# Altium schematic sheet projekt1.SchDoc
size A4
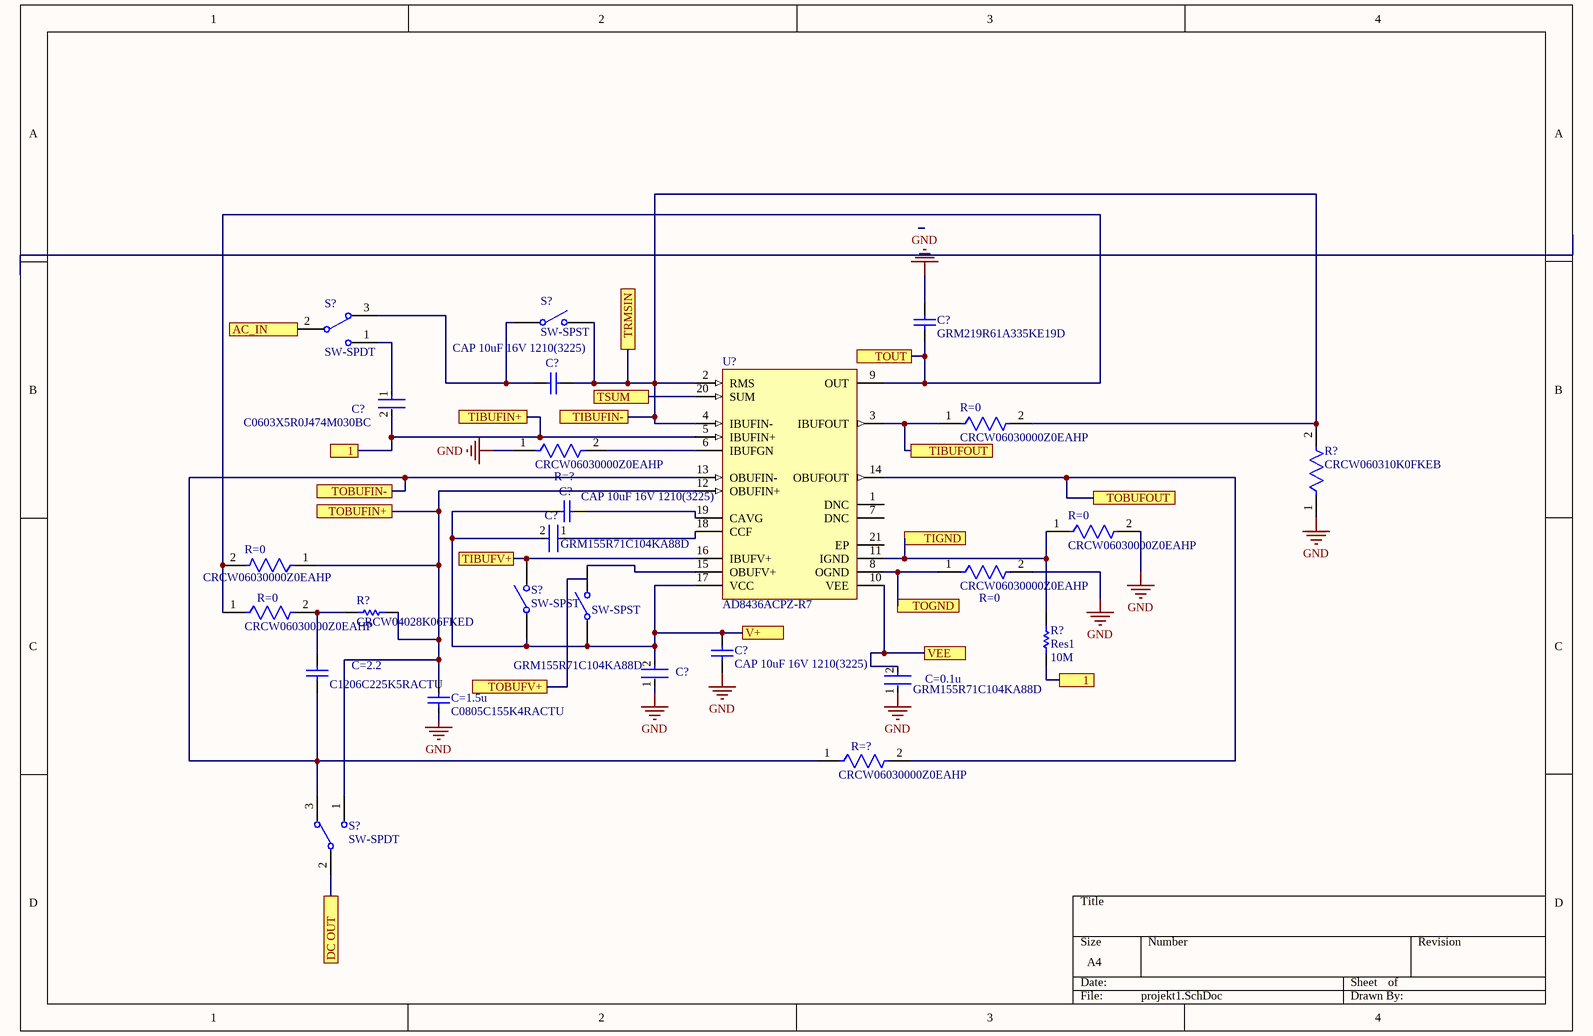
[diagram p0: projekt1.SchDoc]

## Parts
(Parts that share a designator on the sheet are numbered #1, #2 ... from top to bottom, then left to right.)
C=0.1u  GRM155R71C104KA88D  [FP-GRM15-MFG]
C=1.5u  C0805C155K4RACTU  [CAPC2013X140X50NL20T25]
C=2.2  C1206C225K5RACTU  [CAPC3216X180X50LL20T25]
C?#1  GRM219R61A335KE19D  [CAPC2013X95X45ML10T25]
C?#2  CAP 10uF 16V 1210(3225)  [CAPC1210(3225)190_N]
C?#3  C0603X5R0J474M030BC  [FP-C0603-030-0_03-IPC_B]
C?#4  CAP 10uF 16V 1210(3225)  [CAPC1210(3225)190_N]
C?#5  GRM155R71C104KA88D  [FP-GRM15-MFG]
C?#6  GRM155R71C104KA88D  [FP-GRM15-MFG]
C?#7  CAP 10uF 16V 1210(3225)  [CAPC1210(3225)190_N]
R=0#1  CRCW06030000Z0EAHP  [FP-CRCW0603-HPe3-MFG]
R=0#2  CRCW06030000Z0EAHP  [FP-CRCW0603-HPe3-MFG]
R=0#3  CRCW06030000Z0EAHP  [FP-CRCW0603-HPe3-MFG]
R=0#4  CRCW06030000Z0EAHP  [FP-CRCW0603-HPe3-MFG]
R=0#5  CRCW06030000Z0EAHP  [FP-CRCW0603-HPe3-MFG]
R=?#1  CRCW06030000Z0EAHP  [FP-CRCW0603-HPe3-MFG]
R=?#2  CRCW06030000Z0EAHP  [FP-CRCW0603-HPe3-MFG]
R?#1  CRCW060310K0FKEB  [FP-CRCW0603-e3-IPC_B]
R?#2  CRCW04028K06FKED  [RESC1005X40X25ML05T05]
R?#3  Res1  value 10M  [AXIAL-0.3]
S?#1  SW-SPDT  [TL36WW15050]
S?#2  SW-SPST  [SPST-2]
S?#3  SW-SPST  [SPST-2]
S?#4  SW-SPDT  [TL36WW15050]
U?  AD8436ACPZ-R7  [ADI-CP-20-10_M]
  SW-SPST  [SPST-2]

## Ports
1,   TIBUFOUT, AC_IN, DC OUT, TIBUFIN+, TIBUFIN-, TIBUFV+, TIGND, TOBUFIN+, TOBUFIN-, TOBUFOUT, TOBUFV+, TOGND, TOUT, TRMSIN, TSUM, V+, VEE

## Nets
GND: C=0.1u.1 C=1.5u.1 C?#1.2 C?#6.1 C?#7.1 R=0#2.2 R=0#4.2 R=?#1.1 R?#1.1
1: C?#3.2 R?#3.1 U?.5(IBUFIN+) ; port 1, port TIBUFIN+
  TIBUFOUT: R=0#1.1 U?.3(IBUFOUT) ; port   TIBUFOUT
AC_IN: S?#1.2 ; port AC_IN
DC OUT: S?#4.2 ; port DC OUT
TIBUFIN-: C?#2.2 R=0#1.2 R?#1.2 S?#2.2(NO) U?.2(RMS) U?.4(IBUFIN-) ; port TRMSIN, port TIBUFIN-
TIBUFV+: S?#3.2(NO) U?.16(IBUFV+) ; port TIBUFV+
TIGND: R=0#2.1 R?#3.2 U?.11(IGND) ; port TIGND
TOBUFIN+: C=1.5u.2 R=0#3.1 R?#2.2 S?#4.1 U?.12(OBUFIN+) ; port TOBUFIN+
TOBUFIN-: C=2.2.1 R=?#2.1 S?#4.3 U?.13(OBUFIN-) ; port TOBUFIN-
TOBUFOUT: R=?#2.2 U?.14(OBUFOUT) ; port TOBUFOUT
TOGND: R=0#4.1 U?.8(OGND) ; port TOGND
TOUT: C?#1.1 R=0#3.2 R=0#5.1 U?.9(OUT) ; port TOUT
TSUM: U?.20(SUM) ; port TSUM
V+: C?#4.1 C?#5.2 C?#6.2 C?#7.2 S?#3.1(COMMON) U?.17(VCC) .1(COMMON) ; port V+
VEE: C=0.1u.2 U?.10(VEE) ; port VEE
NetC=2.2_2: C=2.2.2 R=0#5.2 R?#2.1
NetC?#2_1: C?#2.1 S?#1.3 S?#2.1(COMMON)
NetC?#3_1: C?#3.1 S?#1.1
NetC?#4_2: C?#4.2 U?.19(CAVG)
NetC?#5_1: C?#5.1 U?.18(CCF)
NetR=?#1_2: R=?#1.2 U?.6(IBUFGN)
NetU?_15: U?.15(OBUFV+) .2(NO)

Not connected (* = marked no-connect by the designer): U? 1(DNC) 7(DNC) 21(EP)

## Library data of the parts
C=0.1u = CMP-2100-03641-2: CAP CER 0.1UF 16V X7R 0402; Manufacturer: Murata; Standoff Height: 0mm; Tolerance: 10%; Description: CAP Ceramic 0.10μF 10% X7R 16Vdc 0402 SMD; Voltage Rating: 16Vdc; Capacitance: 0.10μF; Value: 0.10μF; RoHS: TRUE; Manufacturer Part Number: GRM155R71C104KA88D; Temperature Characteristic: X7R; Octopart: https://octopart.com/grm155r71c104ka88d-murata-196880; Digikey Description: CAP CER 0.1UF 16V X7R 0402; Device Class L3: Ceramic Capacitors; Height: 0.55mm; ComponentLink2Description: Datasheet; Temperature Range Low: -55°C; Ipc Land Pattern Name: CAPC10050X219; ComponentLink2URL: https://search.murata.co.jp/Ceramy/image/img/A01X/G101/ENG/GRM155R71H471KA01-01A.pdf; Device Class L1: Passive Components; Lead Free: yes; Category: Cap; Package: GRM15; Temperature: -55°C to +125°C; Device Class L2: Capacitors; Material: Ceramic; Temperature Range High: +125°C; Mouser Description: 0402 0.1 uF 16V ±10 % Tolerance X7R SMT Multilayer Ceramic Capacitor
C=1.5u = CMP-1036-04795-2: Manufacturer: Kemet; Part Number: C0805C155K4RACTU
C=2.2 = CMP-1037-04831-2: Chip Capacitor, 2.2 uF, +/- 10%, 50 V, -55 to 125 degC, 1206 (3216 Metric), RoHS, Tape and Reel; Manufacturer: Kemet; Case Width: 1.6mm; Capacitance - nF: 2200nF; Capacitance: 2.2uF; Class: Class1; Voltage Rating: 50V; Case Length: 3.2mm; Dielectric: X7R; Temperature Coefficient / Code: +/-15%; Product Category: MultilayerCeramicCapacitorsMLCC-SMD/SMT; Package Description: 2-Pin Surface Mount Device, Body 3.2 x 1.6 mm; Minimum Operating Temperature: -55C; RoHS: Details; Package / Case: 1206(3216metric); Packaging: Reel; Type: SMDMLCCX7R6.3-250VDCCommericalGrade; Case Code - mm: 3216; Datasheet Version: 02/2016; Tolerance: 10%; Series: C1206C; Dimensions: 1.6mmWx3.2mmLx1.6mmH; Case Height: 1.6mm; Brand: Kemet; Mounting Technology: SurfaceMount; Manufacturer URL: http://www.kemet.com/; Voltage Rating DC: 50V; Datasheet URL: http://www.kemet.com/docfinder?Partnumber=C1206C225K5RACTU; Maximum Operating Temperature: +125C; Case Code - in: 1206; Package Reference: 1206; Termination Style: SMD/SMT; Operating Temperature Range: -55Cto+125C; Product: GeneralTypeMLCCs; Factory Pack Quantity: 2000
C?#1 = CMP-2007-00177-1: Manufacturer: Murata; Part Number: GRM219R61A335KE19D
C?#2 C?#4 C?#7 = CMP-1038-02223-1: CAP 10uF 16V -20% to +80% 1210 (3225 Metric) Thickness 1.9mm SMD; Case-EIA: 1210; Case-Metric: 3225; Rated Voltage: 16 V; Tolerance: -20% to +80%; Value: 10uF; Technology: SMT; Max Thickness: 1.9 mm
C?#3 = CMP-08246-005209-1: Multilayer Ceramic Capacitors 470nF ±20% 6.3V X5R SMD 0201; Packaging: Tape and Reel; Voltage Rating: 6.3V; Min Operating Temperature: -55°C; Resistor Type: Ceramic; REACH SVHC: No SVHC; Case Code (Imperial): 0201; Width: 0.012inch; Series: C; Lead Free: Lead Free; Case/Package: 0201; Package Quantity: 1; Dielectric: X5R; Weight: 6E-06oz; Case Code (Metric): 0603; Depth: 0.3mm; Max Operating Temperature: 85°C; Voltage Rating (DC): 6.3V; RoHS Compliant: Yes; Thickness: 300um; Capacitance: 470nF; Mount: Surface Mount; Radiation Hardening: No; Termination: SMD/SMT; Length: 0.6mm; Dielectric Material: Ceramic; Tolerance: 20%
C?#5 C?#6 = CMP-2100-03641-2: CAP CER 0.1UF 16V X7R 0402; Manufacturer: Murata; Standoff Height: 0mm; Tolerance: 10%; Description: CAP Ceramic 0.10μF 10% X7R 16Vdc 0402 SMD; Voltage Rating: 16Vdc; Material: Ceramic; Capacitance: 0.10μF; Value: 0.10μF; RoHS: TRUE; Manufacturer Part Number: GRM155R71C104KA88D; Temperature Characteristic: X7R; Octopart: https://octopart.com/grm155r71c104ka88d-murata-196880; Digikey Description: CAP CER 0.1UF 16V X7R 0402; Device Class L3: Ceramic Capacitors; Height: 0.55mm; ComponentLink2Description: Datasheet; Temperature Range Low: -55°C; Ipc Land Pattern Name: CAPC10050X219; ComponentLink2URL: https://search.murata.co.jp/Ceramy/image/img/A01X/G101/ENG/GRM155R71H471KA01-01A.pdf; Device Class L1: Passive Components; Lead Free: yes; Category: Cap; Package: GRM15; Temperature: -55°C to +125°C; Device Class L2: Capacitors; Temperature Range High: +125°C; Mouser Description: 0402 0.1 uF 16V ±10 % Tolerance X7R SMT Multilayer Ceramic Capacitor
R=0#1-R=0#5 R=?#1 R=?#2 = CMP-2000-03817-2: RES Thick Film, 0Ω, , 0.33W, , 0603; Max Power Dissipation: 250mW; Voltage Rating (DC): 75V; Temperature Coefficient: 0ppm/°C; Resistance: 0mR; Mount: Surface Mount; Package Quantity: 5000; Features: Automotive AEC-Q200; Length: 1.6mm; Width: 0.033inch; Min Operating Temperature: -55°C; Max Operating Temperature: 155°C; Contact Plating: Tin; Depth: 0.85mm; Case/Package: 0603; Radiation Hardening: No; Military Standard: Not; Power Rating: 250mW; Height: 0.45mm; Composition: Thick Film; Lead Free: Lead Free; Voltage Rating: 75V; Case Code (Imperial): 0603; Weight: 7.1E-05oz; Number of Terminations: 2; Packaging: Tape and Reel; Number of Pins: 2; Case Code (Metric): 1608; Termination: SMD/SMT
R?#1 = CMP-2000-03836-2: RES Thick Film, 10kΩ, 1%, 0.1W, 100ppm/°C, 0603; Voltage Rating: 75V; Max Power Dissipation: 100mW; Resistance: 10kR; Min Operating Temperature: -55°C; Packaging: Tape and Reel; Temperature Coefficient: 100ppm/°C; Case/Package: 0603; Max Operating Temperature: 155°C; Package Quantity: 10000; Voltage Rating (DC): 75V; Depth: 0.85mm; Case Code (Imperial): 0603; Power Rating: 100mW; Military Standard: Not; Height: 0.02inch; Weight: 7.1E-05oz; Number of Pins: 2; Width: 0.033inch; Number of Terminations: 2; Contact Plating: Tin; Length: 1.55mm; Features: Automotive AEC-Q200; Lead Free: Lead Free; Tolerance: 1%; Composition: Thick Film; Radiation Hardening: No; Case Code (Metric): 1608
R?#2 = CMP-2002-00253-3: Chip Resistor, 8.06 KOhm, +/- 1%, 63 mW, -55 to 155 degC, 0402 (1005 Metric), RoHS, Tape and Reel; Manufacturer: Basic Passives; Case\/Package: 0402; Power Rating: 63 mW; Voltage Rating: 50 V; PackageReference: 0402; Radiation Hardening: No; Package Quantity: 10000; Height: 0.35 mm; Packaging: Tape and Reel; Mount: Surface Mount; Length: 1 mm; Weight: 2.3E-05oz; Case Code (Metric): 1005; DatasheetVersion: 06/2012; Pins: 2; Min Operating Temperature: -55 degC; PartNumber: CRCW04028K06FKED; Case Code (Imperial): 0402; REACH SVHC: Unknown; Tolerance: 1%; Mounting Technology: Surface Mount; ComponentLink1URL: http://www.vishay.com/; ComponentLink2URL: http://www.vishay.com/docs/20035/dcrcwe3.pdf; ComponentLink2Description: Datasheet; Resistance: 8.06 KOhm; Max Operating Temperature: 155 degC; ComponentLink1Description: Manufacturer URL; Width: 0.5 mm; RoHSCompliant: true; PackageDescription: 2-Pin Surface Mount Device, Body 1 x 0.5 mm
R?#3 = Res1: Resistor; Published: 8-Jun-2000; LatestRevisionDate: 17-Jul-2002; LatestRevisionNote: Re-released for DXP Platform.; PackageReference: AXIAL-0.3; Publisher: Altium Limited; PackageDescription: Axial Device, Thru-Hole; 2 Leads; 0.3 in Pin Spacing
S?#1 S?#4 = SW-SPDT: SPDT Subminiature Toggle Switch, Right Angle Mounting, Vertical Actuation; Published: 24-Mar-1999; LatestRevisionDate: 17-Dec-2003; LatestRevisionNote: Schematic revised, PCB Footprint replaced.; DatasheetVersion: 05-Dec-2000; PackageReference: TL36WW15050; Publisher: Altium Limited; PackageDescription: Switch; 4 Leads; ComponentLink1Description: Manufacturer Link; ComponentLink1URL: http://www.apem.com
S?#2 S?#3  = SW-SPST: Single-Pole, Single-Throw Switch; Published: 24-Mar-1999; LatestRevisionDate: 17-Jul-2002; LatestRevisionNote: Re-released for DXP Platform.; PackageReference: SPST-2; Publisher: Altium Limited; PackageDescription: Switch; 2 Leads
U? = CMP-0527-00003-3: Low Cost, Low Power, True RMS-to-DC Converter, 4.8 to 36 V Single Supply, -40 to 125 degC, 20-Pin QFN (CP-20-10); Manufacturer: Analog Devices; -3dB Bandwidth: 950 KHz; Max Vin (V-rms): 3 V rms; V Span (min): 4.8 V; Supply Current: 300 uA; V Span (max): 36 V; Error (%@ CF: 3)=0.5; PackageVersion: Rev. B; DatasheetVersion: Rev. B; PackageDescription: 20-Pin Frame Chip Scale Package, Body 4 x 4 mm, Pitch 0.5 mm; ComponentLink3URL: http://www.analog.com/static/imported-files/packages/PKG_PDF/LFCSP(CP)/CP_20_10.pdf; ComponentLink2Description: Datasheet; ComponentLink1Description: Manufacturer URL; Operating Temperature Range: -40 to 125 degC; ComponentLink1URL: http://www.analog.com/; ComponentLink3Description: Package Specification; RoHS: TRUE; PartNumber: AD8436ACPZ-R7; PackageReference: CP-20-10; ComponentLink2URL: http://www.analog.com/static/imported-files/data_sheets/AD8436.pdf; Mounting Technology: Surface Mount